# Altium schematic sheet CAN.SchDoc
size A4
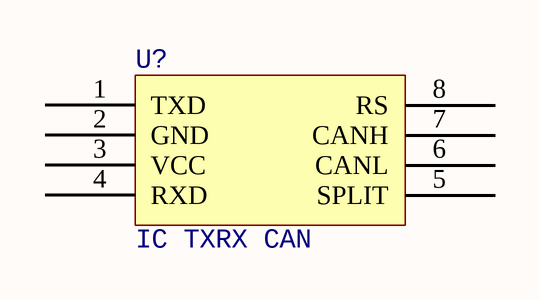
[diagram p0: CAN.SchDoc]

## Parts
U?  IC TXRX CAN  [LT-S8_N]

## Nets

Not connected (* = marked no-connect by the designer): U? 1(TXD) 2(GND) 3(VCC) 4(RXD) 5(SPLIT) 6(CANL) 7(CANH) 8(RS)

## Library data of the parts
U? = LTC2875: IC TXRX CAN 4MBPS 8SO; Manufacturer: Linear Technologies; MPN: LTC2875IS8#PBF; Package: 8-SOIC (0.154", 3.90mm Width); ComponentLink1Description: Datasheet; ComponentLink1URL: https://www.analog.com/media/en/technical-documentation/data-sheets/2875f.pdf; Digikey Part Number: LTC2875IS8#PBF-ND